# EAGLE schematic Redundancy (EAGLE 7.6.0)
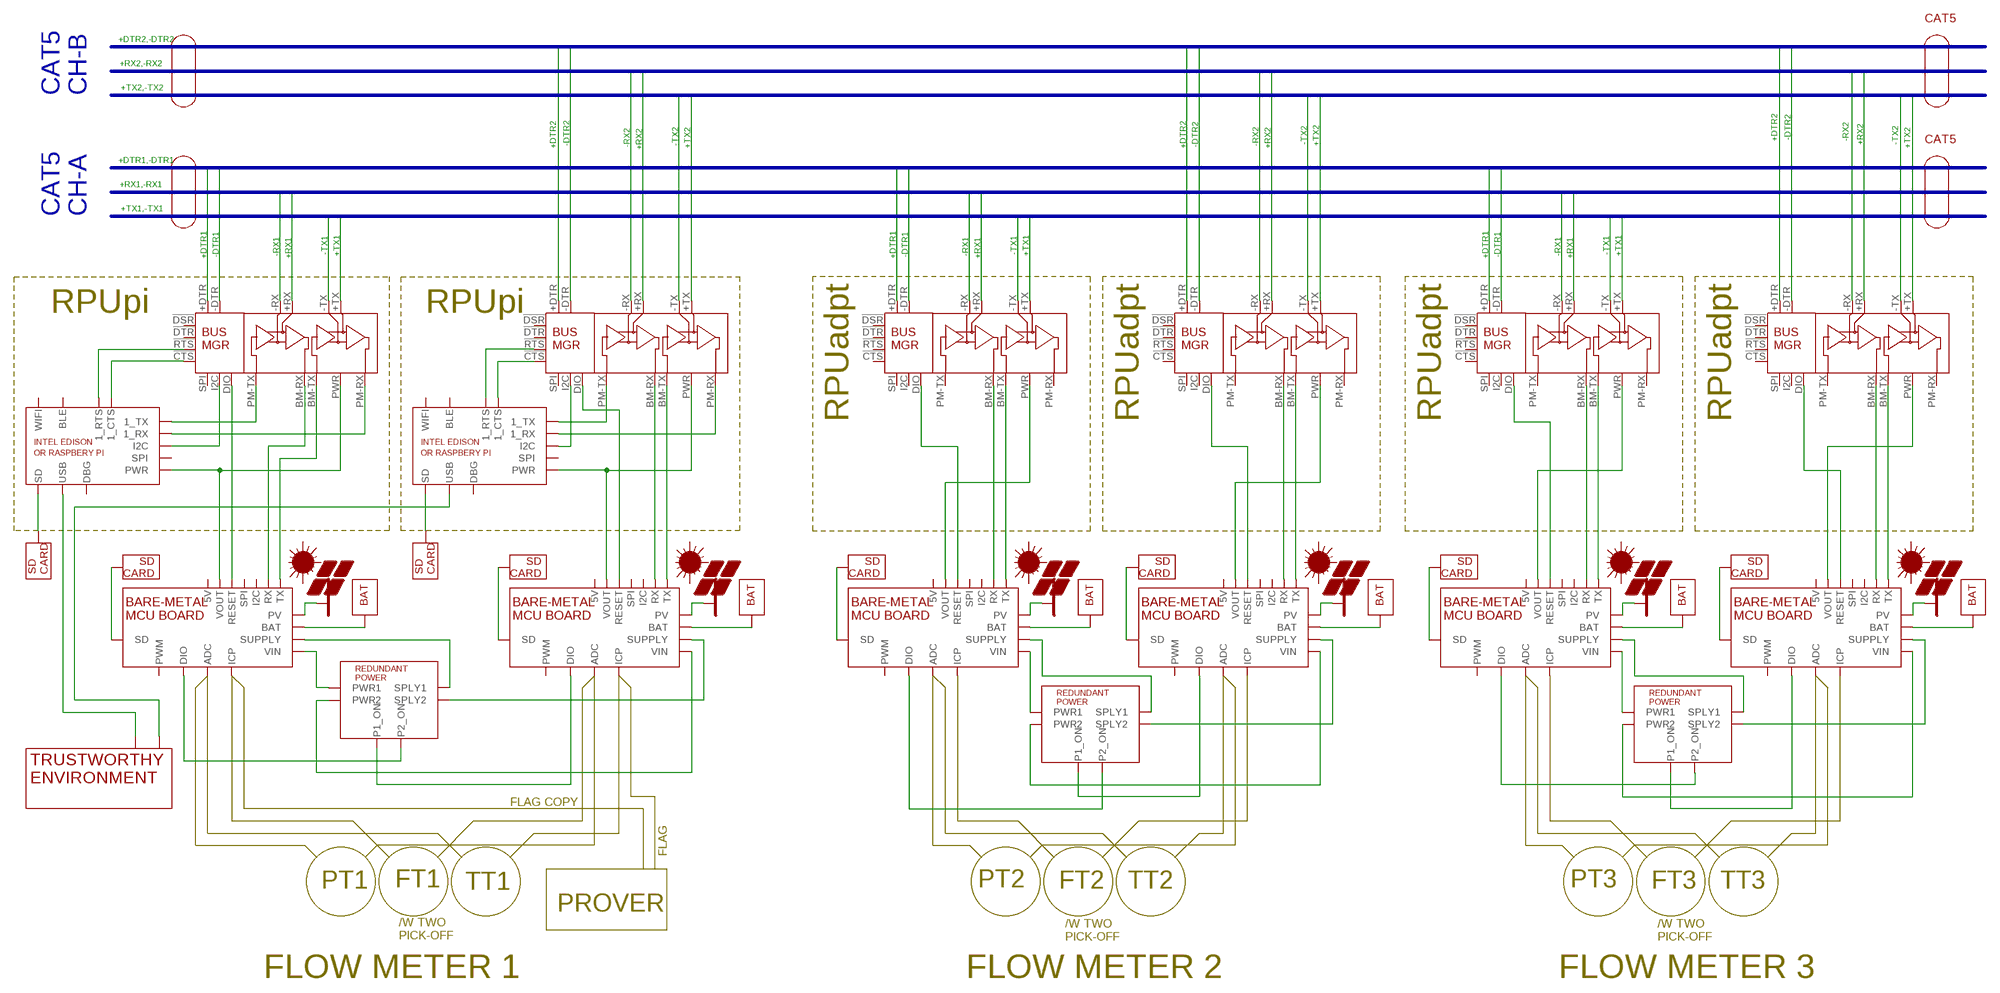
[diagram p0: schematic, sheet 1]

## Parts
BM1  BARE-METAL  [NA-20]
BM2  BARE-METAL  [NA-20]
BM3  BARE-METAL  [NA-20]
BM4  BARE-METAL  [NA-20]
BM5  BARE-METAL  [NA-20]
BM6  BARE-METAL  [NA-20]
PM1  TRUSTWORTHY  [NA-20]
PV1  PV  [NA-20]
PV2  PV  [NA-20]
PV3  PV  [NA-20]
PV4  PV  [NA-20]
PV5  PV  [NA-20]
PV6  PV  [NA-20]
SD1  SD  [NA-20]
SD2  SD  [NA-20]
SD3  SD  [NA-20]
SD4  SD  [NA-20]
SD5  SD  [NA-20]
SD6  SD  [NA-20]
SD7  SD  [NA-20]
SD8  SD  [NA-20]
U$1  BUS_MGR  [NA-10_WITH_RPU_NAMES]
U$2  BUS_MGR  [NA-10_WITH_RPU_NAMES]
U$3  BUS_MGR  [NA-10_WITH_RPU_NAMES]
U$4  BUS_MGR  [NA-10_WITH_RPU_NAMES]
U$5  EDISON  [NA-20]
U$6  EDISON  [NA-20]
U$7  BAT  [NA-20]
U$8  BAT  [NA-20]
U$9  BAT  [NA-20]
U$10  BAT  [NA-20]
U$11  BUS_MGR  [NA-10_WITH_RPU_NAMES]
U$12  BUS_MGR  [NA-10_WITH_RPU_NAMES]
U$13  BAT  [NA-20]
U$14  BAT  [NA-20]
U$15  REDUNDANT_PWR  [NA-20]
U$16  REDUNDANT_PWR  [NA-20]
U$17  REDUNDANT_PWR  [NA-20]

## Nets
+DTR1: U$1.+DTR U$3.+DTR U$11.+DTR
+DTR2: U$2.+DTR U$4.+DTR U$12.+DTR
+RX1: U$1.+RX U$3.+RX U$11.+RX
+RX2: U$2.+RX U$4.+RX U$12.+RX
+TX1: U$1.+TX U$3.+TX U$11.+TX
+TX2: U$2.+TX U$4.+TX U$12.+TX
-DTR1: U$1.-DTR U$3.-DTR U$11.-DTR
-DTR2: U$2.-DTR U$4.-DTR U$12.-DTR
-RX1: U$1.-RX U$3.-RX U$11.-RX
-RX2: U$2.-RX U$4.-RX U$12.-RX
-TX1: U$1.-TX U$3.-TX U$11.-TX
-TX2: U$2.-TX U$4.-TX U$12.-TX
N$1: BM4.1(TX) U$1.BM-TX(BM_TX)
N$2: BM4.2(RX) U$1.BM-RX(BM_RX)
N$3: PM1.1(RX) U$5.11(USB)
N$4: U$1.!CTS U$5.1(1_CTS)
N$5: U$1.!RTS U$5.2(1_RTS)
N$7: BM3.12(VOUT) U$2.PWR U$6.12(PWR)
N$8: U$1.PM-RX(PM_RX) U$5.3(1_RX)
N$9: U$1.PM-TX(PM_TX) U$5.4(1_TX)
N$10: U$2.!CTS U$6.1(1_CTS)
N$11: U$2.!RTS U$6.2(1_RTS)
N$12: SD2.1(PV_PWR) U$6.9(SD)
N$13: SD1.1(PV_PWR) U$5.9(SD)
N$14: BM1.11(SD) SD4.1(PV_PWR)
N$15: PM1.2(TX) U$6.11(USB)
N$16: BM2.13(RESET) U$3.DIO
N$17: BM3.1(TX) U$2.BM-TX(BM_TX)
N$18: BM3.2(RX) U$2.BM-RX(BM_RX)
N$19: U$2.PM-RX(PM_RX) U$6.3(1_RX)
N$20: U$2.PM-TX(PM_TX) U$6.4(1_TX)
N$21: BM2.1(TX) U$3.BM-TX(BM_TX)
N$22: BM2.2(RX) U$3.BM-RX(BM_RX)
N$23: BM1.12(VOUT) U$4.PWR
N$24: BM2.5(PV) PV3.1(PV_PWR)
N$25: BM2.11(SD) SD3.1(PV_PWR)
N$26: BM4.5(PV) PV1.1(PV_PWR)
N$27: BM3.9(DIO) U$15.1(P1_ON)
N$28: BM4.14(SUPPLY) U$15.5(SPLY1)
N$29: U$1.I2C U$5.8(I2C)
N$30: BM3.13(RESET) U$2.DIO
N$31: BM2.16(VIN) U$16.3(PWR1)
N$32: BM1.13(RESET) U$4.DIO
N$33: BM3.5(PV) PV2.1(PV_PWR)
N$34: BM6.1(TX) U$11.BM-TX(BM_TX)
N$35: BM6.2(RX) U$11.BM-RX(BM_RX)
N$36: BM6.13(RESET) U$11.DIO
N$37: BM5.13(RESET) U$12.DIO
N$38: BM5.1(TX) U$12.BM-TX(BM_TX)
N$39: BM2.14(SUPPLY) U$16.5(SPLY1)
N$40: BM1.1(TX) U$4.BM-TX(BM_TX)
N$41: BM1.2(RX) U$4.BM-RX(BM_RX)
N$42: BM1.5(PV) PV4.1(PV_PWR)
N$43: BM5.2(RX) U$12.BM-RX(BM_RX)
N$44: BM5.5(PV) PV6.1(PV_PWR)
N$45: BM5.11(SD) SD6.1(PV_PWR)
N$46: BM5.12(VOUT) U$12.PWR
N$47: BM6.5(PV) PV5.1(PV_PWR)
N$48: BM6.11(SD) SD5.1(PV_PWR)
N$49: BM1.16(VIN) U$16.4(PWR2)
N$50: BM1.14(SUPPLY) U$16.6(SPLY2)
N$51: BM2.12(VOUT) U$3.PWR
N$52: BM6.12(VOUT) U$11.PWR
N$54: BM4.12(VOUT) U$1.PWR U$5.12(PWR)
N$55: BM4.11(SD) SD8.1(PV_PWR)
N$56: BM3.11(SD) SD7.1(PV_PWR)
N$57: BM4.9(DIO) U$15.2(P2_ON)
N$58: BM4.13(RESET) U$1.DIO
N$59: BM4.16(VIN) U$15.3(PWR1)
N$60: BM3.16(VIN) U$15.4(PWR2)
N$61: BM3.14(SUPPLY) U$15.6(SPLY2)
N$62: U$2.I2C U$6.8(I2C)
N$63: BM1.9(DIO) U$16.1(P1_ON)
N$64: BM2.9(DIO) U$16.2(P2_ON)
N$65: BM6.14(SUPPLY) U$17.5(SPLY1)
N$66: BM6.16(VIN) U$17.3(PWR1)
N$67: BM5.16(VIN) U$17.4(PWR2)
N$68: BM5.14(SUPPLY) U$17.6(SPLY2)
N$69: BM5.9(DIO) U$17.1(P1_ON)
N$70: BM6.9(DIO) U$17.2(P2_ON)
N$71: BM4.6(BAT) U$7.1(BAT_PWR)
N$72: BM3.6(BAT) U$8.1(BAT_PWR)
N$73: BM2.6(BAT) U$9.1(BAT_PWR)
N$74: BM1.6(BAT) U$10.1(BAT_PWR)
N$75: BM6.6(BAT) U$13.1(BAT_PWR)
N$76: BM5.6(BAT) U$14.1(BAT_PWR)
Unconnected: BM1.3(I2C) BM1.4(SPI) BM1.7(ICP) BM1.8(ADC) BM1.10(PWM) BM1.15(5V) BM2.3(I2C) BM2.4(SPI) BM2.7(ICP) BM2.8(ADC) BM2.10(PWM) BM2.15(5V) BM3.3(I2C) BM3.4(SPI) BM3.7(ICP) BM3.8(ADC) BM3.10(PWM) BM3.15(5V) BM4.3(I2C) BM4.4(SPI) BM4.7(ICP) BM4.8(ADC) BM4.10(PWM) BM4.15(5V) BM5.3(I2C) BM5.4(SPI) BM5.7(ICP) BM5.8(ADC) BM5.10(PWM) BM5.15(5V) BM6.3(I2C) BM6.4(SPI) BM6.7(ICP) BM6.8(ADC) BM6.10(PWM) BM6.15(5V) U$1.!DSR U$1.!DTR U$1.SPI U$2.!DSR U$2.!DTR U$2.SPI U$3.!CTS U$3.!DSR U$3.!DTR U$3.!RTS U$3.I2C U$3.PM-RX(PM_RX) U$3.PM-TX(PM_TX) U$3.SPI U$4.!CTS U$4.!DSR U$4.!DTR U$4.!RTS U$4.I2C U$4.PM-RX(PM_RX) U$4.PM-TX(PM_TX) U$4.SPI U$5.5(WIFI) U$5.6(BLE) U$5.7(DBG) U$5.10(SPI) U$6.5(WIFI) U$6.6(BLE) U$6.7(DBG) U$6.10(SPI) U$11.!CTS U$11.!DSR U$11.!DTR U$11.!RTS U$11.I2C U$11.PM-RX(PM_RX) U$11.PM-TX(PM_TX) U$11.SPI U$12.!CTS U$12.!DSR U$12.!DTR U$12.!RTS U$12.I2C U$12.PM-RX(PM_RX) U$12.PM-TX(PM_TX) U$12.SPI

## Buses
+DTR2,-DTR2
+RX2,-RX2
+TX2,-TX2
+DTR1,-DTR1
+RX1,-RX1
+TX1,-TX1

## Notes on the sheet
- CAT5
- CAT5
  CH-B
- CAT5
- CAT5
  CH-A
- RPUpi | RPUpi
- RPUadpt | RPUadpt | RPUadpt | RPUadpt
- FLAG COPY
- FLAG
- PT1 | FT1 | TT1 | PT2 | FT2 | TT2 | PT3 | FT3 | TT3
- PROVER
- /W TWO 
  PICK-OFF
- /W TWO 
  PICK-OFF
- /W TWO 
  PICK-OFF
- FLOW METER 1 | FLOW METER 2 | FLOW METER 3

## Library data of the parts
BM1-BM6 = Documentation:BARE-METAL: Bare Metal
PM1 = Documentation:TRUSTWORTHY: Protected Mode
PV1-PV6 = Documentation:PV
SD1-SD8 = Documentation:SD
U$1-U$4 U$11 U$12 = Documentation:BUS_MGR: RPU BUS MANAGER
U$5 U$6 = Documentation:EDISON: Edison
U$7-U$10 U$13 U$14 = Documentation:BAT
U$15-U$17 = Documentation:REDUNDANT_PWR